# Altium project AD5940PSTAT.PrjPcb
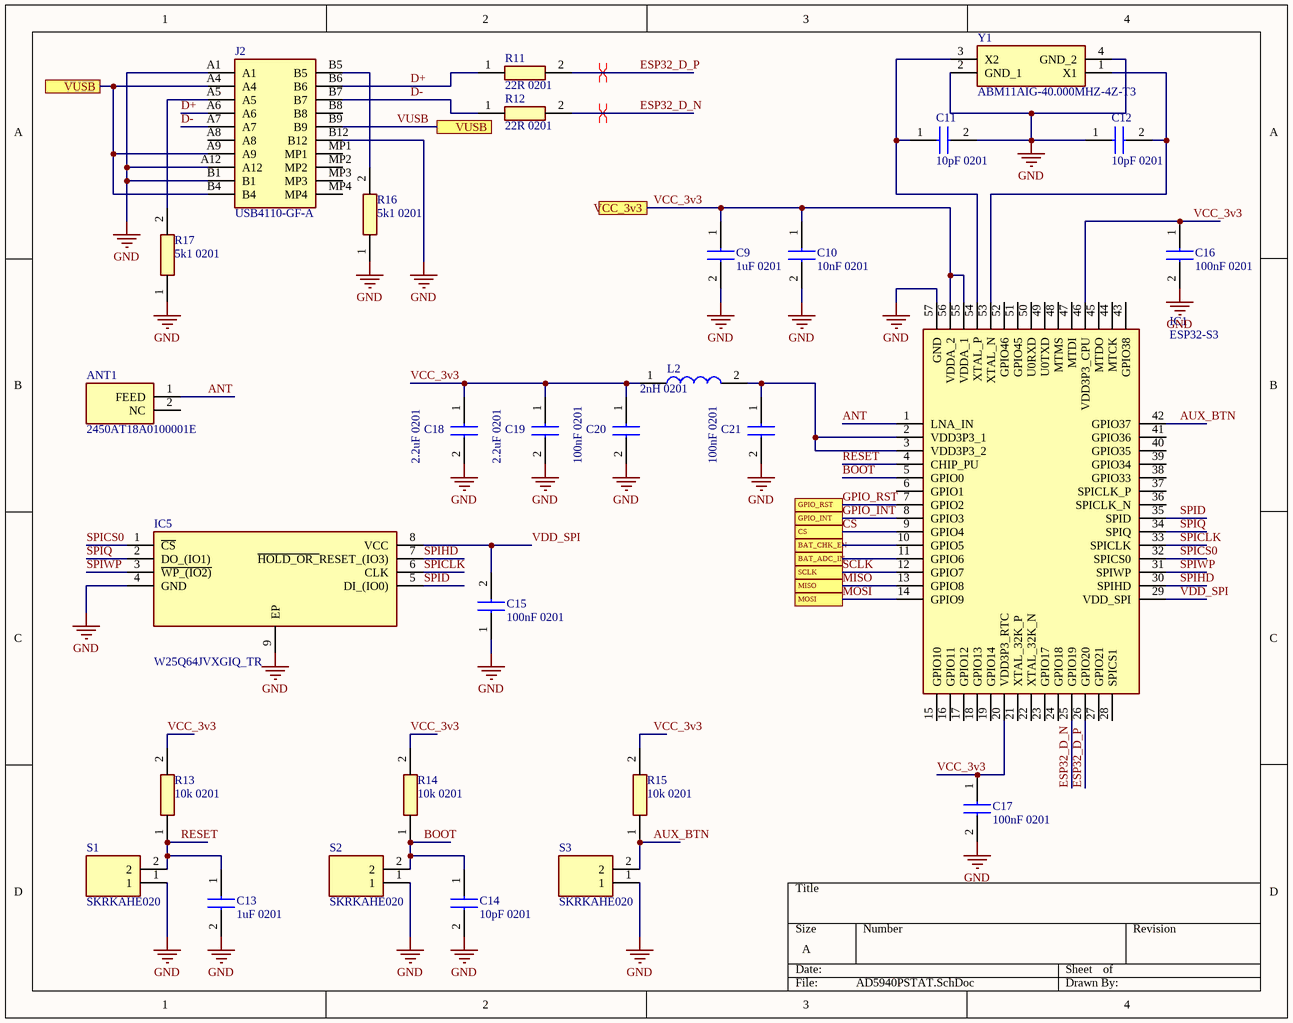
[diagram p0: AD5940PSTAT.SchDoc]
3 sheets, 70 parts. Net scope: flat (ports and power ports of the same name join across sheets).
Board file: AD5940PSTAT.PcbDoc
Sheets:
  AD5940PSTAT.SchDoc
  Battery_MGMT.SchDoc
  AD5940.SchDoc

## Sheet AD5940PSTAT.SchDoc
size A; SheetNumber: 1; SheetTotal: 3

### Parts
ANT1  2450AT18A0100001E  [2450AT18A0100001E]
C9  1uF 0201  [CAPC0603X33N]
C10  10nF 0201  [CAPC0603X33N]
C11  10pF 0201  [CAPC0603X33N]
C12  10pF 0201  [CAPC0603X33N]
C13  1uF 0201  [CAPC0603X33N]
C14  10pF 0201  [CAPC0603X33N]
C15  100nF 0201  [CAPC0603X33N]
C16  100nF 0201  [CAPC0603X33N]
C17  100nF 0201  [CAPC0603X33N]
C18  2.2uF 0201  [CAPC0603X33N]
C19  2.2uF 0201  [CAPC0603X33N]
C20  100nF 0201  [CAPC0603X33N]
C21  100nF 0201  [CAPC0603X33N]
IC1  ESP32-S3  [QFN40P700X700X90-57N-D]
IC5  W25Q64JVXGIQ_TR  [SON80P400X400X50-9N]
J2  USB4110-GF-A  [USB4110GFA]
L2  2nH 0201  [LQP03TG3N1B02D]
R11  22R 0201  [RESC0603X28N]
R12  22R 0201  [RESC0603X28N]
R13  10k 0201  [RESC0603X28N]
R14  10k 0201  [RESC0603X28N]
R15  10k 0201  [RESC0603X28N]
R16  5k1 0201  [RESC0603X28N]
R17  5k1 0201  [RESC0603X28N]
S1  SKRKAHE020  [SKRKAEE020]
S2  SKRKAHE020  [SKRKAEE020]
S3  SKRKAHE020  [SKRKAEE020]
Y1  ABM11AIG-40.000MHZ-4Z-T3  [ABM11AIG16000MHZ81ZT]

### Ports
BAT_ADC_IN (see Battery_MGMT[4B]), BAT_CHK_EN (see Battery_MGMT[3B]), CS (see AD5940[4B]), GPIO_INT (see AD5940[4B]), GPIO_RST (see AD5940[4B]), MISO (see AD5940[4B]), MOSI (see AD5940[4B]), SCLK (see AD5940[4B]), VCC_3v3 (see Battery_MGMT[4C]), VUSB (see AD5940PSTAT[1A], Battery_MGMT[1C]), VUSB (see AD5940PSTAT[2A], Battery_MGMT[1C])

### Nets
GND: C9.2 C10.2 C11.2 C12.1 C13.2 C14.2 C15.1 C16.2 C17.2 C18.2 C19.2 C20.2 C21.2 IC1.57(GND) IC5.4(GND) IC5.9(EP) J2.A1 J2.A12 J2.B1 J2.B12 R16.1 R17.1 S1.1 S2.1 S3.1 Y1.2(GND_1) Y1.4(GND_2)
\: C14.1 IC1.5(GPIO0) R14.1 S2.2  [also labelled BOOT]
ANT: ANT1.1(FEED) IC1.1(LNA_IN)
AUX_BTN: IC1.42(GPIO37) R15.1 S3.2
CS: IC1.9(GPIO4) ; port CS
D+: J2.A6 J2.B6 R11.1
D-: J2.A7 J2.B7 R12.1
ESP32_D_N: IC1.25(GPIO19) R12.2
ESP32_D_P: IC1.26(GPIO20) R11.2
GPIO_INT: IC1.8(GPIO3) ; port GPIO_INT
GPIO_RST: IC1.7(GPIO2) ; port GPIO_RST
MISO: IC1.13(GPIO8) ; port MISO
MOSI: IC1.14(GPIO9) ; port MOSI
RESET: C13.1 IC1.4(CHIP_PU) R13.1 S1.2
SCLK: IC1.12(GPIO7) ; port SCLK
SPICLK: IC1.33(SPICLK) IC5.6(CLK)
SPICS0: IC1.32(SPICS0) IC5.1(~{CS})
SPID: IC1.35(SPID) IC5.5(DI_(IO0))
SPIHD: IC1.30(SPIHD) IC5.7(~{HOLD_OR_}RESET_(IO3))
SPIQ: IC1.34(SPIQ) IC5.2(DO_(IO1))
SPIWP: IC1.31(SPIWP) IC5.3(~{WP_(IO2)})
VCC_3v3: C9.1 C10.1 C16.1 C17.1 C18.1 C19.1 C20.1 IC1.20(VDD3P3_RTC) IC1.46(VDD3P3_CPU) IC1.55(VDDA_1) IC1.56(VDDA_2) L2.1 R13.2 R14.2 R15.2 ; port VCC_3v3
VDD_SPI: C15.2 IC1.29(VDD_SPI) IC5.8(VCC)
VUSB: J2.A4 J2.A9 J2.B4 J2.B9 ; port VUSB
NetC11_1: C11.1 IC1.54(XTAL_P) Y1.3(X2)
NetC12_2: C12.2 IC1.53(XTAL_N) Y1.1(X1)
NetC21_1: C21.1 IC1.2(VDD3P3_1) IC1.3(VDD3P3_2) L2.2
NetIC1_10: IC1.10(GPIO5) ; port BAT_CHK_EN
NetIC1_11: IC1.11(GPIO6) ; port BAT_ADC_IN
NetJ2_A5: J2.A5 R17.2
NetJ2_B5: J2.B5 R16.2

Not connected (* = marked no-connect by the designer): ANT1 2(NC); IC1 6(GPIO1) 15(GPIO10) 16(GPIO11) 17(GPIO12) 18(GPIO13) 19(GPIO14) 21(XTAL_32K_P) 22(XTAL_32K_N) 23(GPIO17) 24(GPIO18) 27(GPIO21) 28(SPICS1) 36(SPICLK_N) 37(SPICLK_P) 38(GPIO33) 39(GPIO34) 40(GPIO35) 41(GPIO36) 43(GPIO38) 44(MTCK) 45(MTDO) 47(MTDI) 48(MTMS) 49(U0TXD) 50(U0RXD) 51(GPIO45) 52(GPIO46); J2 A8 B8 MP1 MP2 MP3 MP4

### Layout directives
differential pair: ESP32_D_N, ESP32_D_P

### Library data of the parts
ANT1 = 2450AT18A0100001E: Antenna; Manufacturer_Name: JOHANSON TECHNOLOGY; Datasheet Link: https://www.johansontechnology.com/datasheets/2450AT18A100/2450AT18A100.pdf; Height: 1.4mm; Manufacturer_Part_Number: 2450AT18A0100001E
C9-C21 = 02013A0R5BAT2A: Capacitor; Manufacturer_Name: Kyocera AVX; Datasheet Link: http://www.mouser.com/catalog/supplier/library/pdf/AVXSurfaceMountCeramic.pdf; Height: 0.33mm; Manufacturer_Part_Number: 02013A0R5BAT2A; Mouser Part Number: 581-02013A0R5BAT2A; Mouser Price/Stock: https://www.mouser.co.uk/ProductDetail/KYOCERA-AVX/02013A0R5BAT2A?qs=Thry1QCnmXDPtFIq9lj3NA%3D%3D
IC1 = ESP32-S3: Integrated Circuit; Manufacturer_Name: Espressif Systems; Datasheet Link: https://nl.mouser.com/datasheet/2/891/Espressif_ESP32_S3_Datasheet-2904763.pdf; Height: 0.9mm; Manufacturer_Part_Number: ESP32-S3; Mouser Part Number: 356-ESP32-S3; Mouser Price/Stock: https://www.mouser.co.uk/ProductDetail/Espressif-Systems/ESP32-S3?qs=Rp5uXu7WBW%2FNWuUy%252BBihNw%3D%3D
IC5 = W25Q64JVXGIQ_TR: Integrated Circuit; Manufacturer_Name: Winbond; Manufacturer_Part_Number: W25Q64JVXGIQ TR; Datasheet Link: https://www.mouser.com/datasheet/2/949/w25q64jv_revj_03272018_plus-1489671.pdf; Height: 0.5mm; Mouser Part Number: 454-W25Q64JVXGIQTR; Mouser Price/Stock: https://www.mouser.co.uk/ProductDetail/Winbond/W25Q64JVXGIQ-TR?qs=qSfuJ%252Bfl%2Fd5kgMLGcal3yA%3D%3D; Arrow Part Number: W25Q64JVXGIQ TR; Arrow Price/Stock: https://www.arrow.com/en/products/w25q64jvxgiqtr/winbond-electronics?utm_currency=USD&region=nac
J2 = USB4110-GF-A: Connector; Manufacturer_Name: GCT (GLOBAL CONNECTOR TECHNOLOGY); Datasheet Link: https://gct.co/files/drawings/usb4110.pdf; Height: 3.26mm; Manufacturer_Part_Number: USB4110-GF-A; Mouser Part Number: 640-USB4110-GF-A; Mouser Price/Stock: https://www.mouser.co.uk/ProductDetail/GCT/USB4110-GF-A?qs=KUoIvG%2F9IlYiZvIXQjyJeA%3D%3D
L2 = LQP03TN2N0C02D: Inductor; Manufacturer_Name: Murata Electronics; Datasheet Link: https://search.murata.co.jp/Ceramy/image/img/P02/JELF243C-0015.pdf; Height: 0.33mm; Manufacturer_Part_Number: LQP03TN2N0C02D; Mouser Part Number: 81-LQP03TN2N0C02D; Mouser Price/Stock: https://www.mouser.co.uk/ProductDetail/Murata-Electronics/LQP03TN2N0C02D?qs=e%252BE4OD6MgMf9XeFWsUHDiQ%3D%3D; Arrow Part Number: LQP03TN2N0C02D; Arrow Price/Stock: https://www.arrow.com/en/products/lqp03tn2n0c02d/murata-manufacturing?region=nac
R11-R17 = CPF0201D422RE1: Resistor; Manufacturer_Name: TE Connectivity; Datasheet Link: http://www.te.com/commerce/DocumentDelivery/DDEController?Action=showdoc&DocId=Data+Sheet%7F1773200-1%7FA%7Fpdf%7FEnglish%7FENG_DS_1773200-1_A.pdf%7F4-2176215-6; Height: 0.28mm; Manufacturer_Part_Number: CPF0201D422RE1
S1-S3 = SKRKAHE020: Switch; Manufacturer_Name: ALPS Electric; Datasheet Link: https://www.alps.com/prod/info/E/HTML/Tact/SurfaceMount/SKRK/SKRKAHE020.html; Height: 2mm; Manufacturer_Part_Number: SKRKAHE020; Mouser Part Number: 688-SKRKAHE010; Mouser Price/Stock: https://www.mouser.co.uk/ProductDetail/Alps-Alpine/SKRKAHE020?qs=chTDxNqvsymUfAVYmcFXaw%3D%3D
Y1 = ABM11AIG-40.000MHZ-4Z-T3: Crystal or Oscillator; Manufacturer_Name: ABRACON; Datasheet Link: https://abracon.com/AIGcrystals/ABM11AIG.pdf; Height: 0.55mm; Manufacturer_Part_Number: ABM11AIG-40.000MHZ-4Z-T3; Mouser Part Number: 815-M11AIG-40-4ZT3; Mouser Price/Stock: https://www.mouser.com/Search/Refine.aspx?Keyword=815-M11AIG-40-4ZT3

## Sheet Battery_MGMT.SchDoc
size A; SheetNumber: 2; SheetTotal: 3
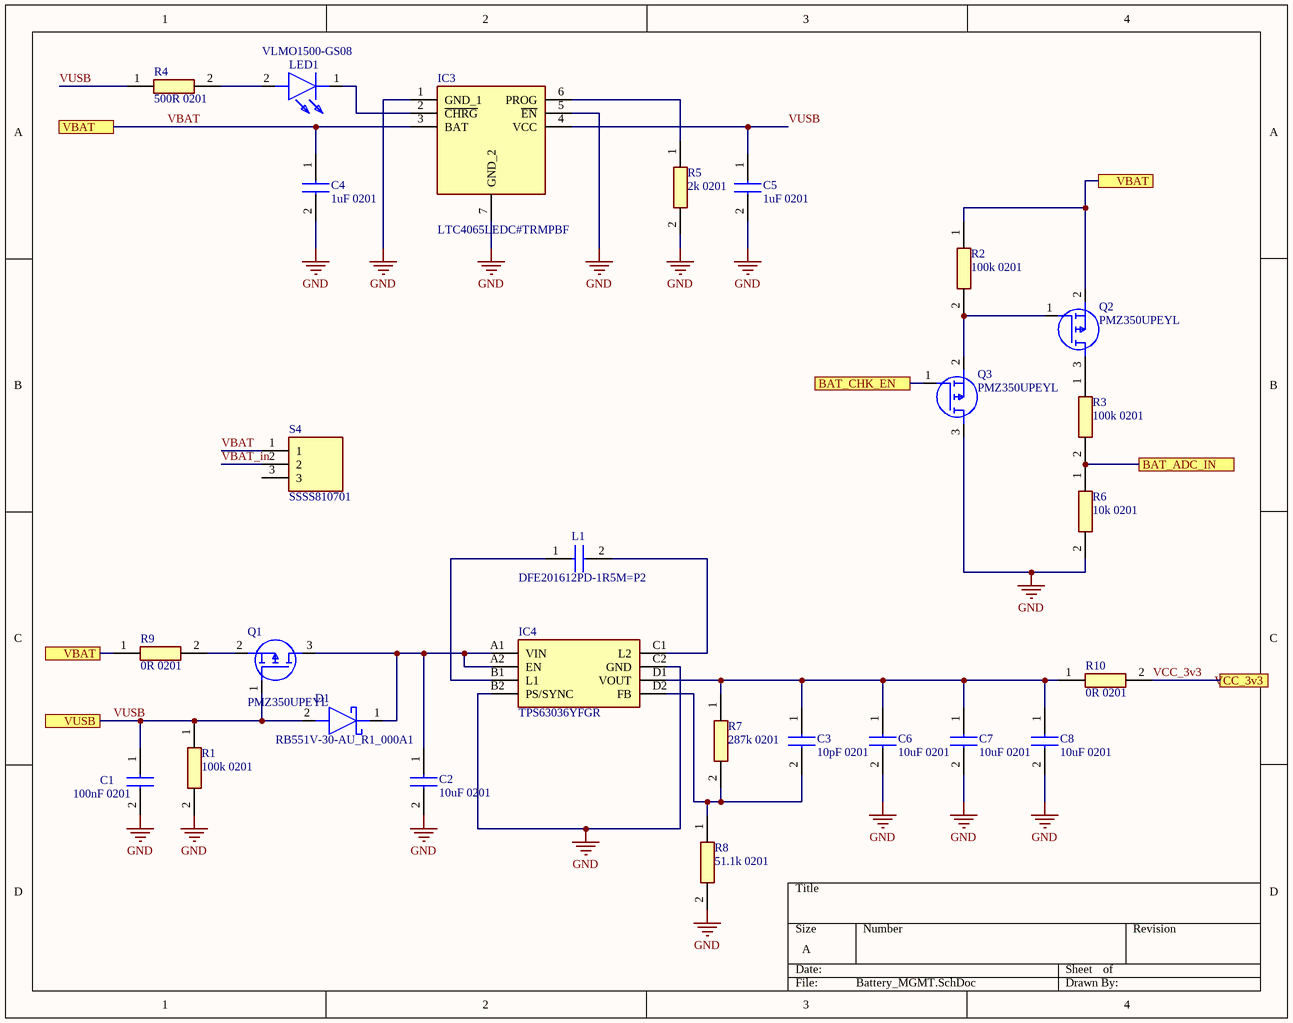
[diagram p1: Battery_MGMT.SchDoc]

### Parts
C1  100nF 0201  [CAPC0603X33N]
C2  10uF 0201  [CAPC0603X33N]
C3  10pF 0201  [CAPC0603X33N]
C4  1uF 0201  [CAPC0603X33N]
C5  1uF 0201  [CAPC0603X33N]
C6  10uF 0201  [CAPC0603X33N]
C7  10uF 0201  [CAPC0603X33N]
C8  10uF 0201  [CAPC0603X33N]
D1  RB551V-30-AU_R1_000A1  [SODFL2512X90N]
IC3  LTC4065LEDC#TRMPBF  [SON50P200X200X80-7N-D]
IC4  TPS63036YFGR  [BGA8C40P2X4_108X181X62]
L1  DFE201612PD-1R5M=P2  [1286ASH1R0MP2]
LED1  VLMO1500-GS08  [VLMO1500GS08]
Q1  PMZ350UPEYL  [PMZ350UPEYL]
Q2  PMZ350UPEYL  [PMZ350UPEYL]
Q3  PMZ350UPEYL  [PMZ350UPEYL]
R1  100k 0201  [RESC0603X28N]
R2  100k 0201  [RESC0603X28N]
R3  100k 0201  [RESC0603X28N]
R4  500R 0201  [RESC0603X28N]
R5  2k 0201  [RESC0603X28N]
R6  10k 0201  [RESC0603X28N]
R7  287k 0201  [RESC0603X28N]
R8  51.1k 0201  [RESC0603X28N]
R9  0R 0201  [RESC0603X28N]
R10  0R 0201  [RESC0603X28N]
S4  SSSS810701  [SSSS810701]

### Ports
BAT_ADC_IN (see AD5940PSTAT[3C]), BAT_CHK_EN (see AD5940PSTAT[3C]), VBAT (see Battery_MGMT[1A], Battery_MGMT[1C]), VBAT (see Battery_MGMT[1A], Battery_MGMT[4A]), VBAT (see Battery_MGMT[1C], Battery_MGMT[4A]), VCC_3v3 (see AD5940[2C], AD5940PSTAT[2A]), VUSB (see AD5940PSTAT[1A], AD5940PSTAT[2A])

### Nets
GND: C1.2 C2.2 C4.2 C5.2 C6.2 C7.2 C8.2 IC3.1(GND_1) IC3.5(~{EN}) IC3.7(GND_2) IC4.B2(PS/SYNC) IC4.C2(GND) Q3.3(D) R1.2 R5.2 R6.2 R8.2
VBAT: C4.1 IC3.3(BAT) Q2.2(S) R2.1 R9.1 S4.1 ; port VBAT
VBAT_in: S4.2
VCC_3v3: R10.2 ; port VCC_3v3
VUSB: C1.1 C5.1 D1.2(A) IC3.4(VCC) Q1.1(G) R1.1 R4.1 ; port VUSB
NetC2_1: C2.1 D1.1(K) IC4.A1(VIN) IC4.A2(EN) Q1.3(D)
NetC3_1: C3.1 C6.1 C7.1 C8.1 IC4.D1(VOUT) R7.1 R10.1
NetC3_2: C3.2 IC4.D2(FB) R7.2 R8.1
NetIC1_10: Q3.1(G) ; port BAT_CHK_EN
NetIC1_11: R3.2 R6.1 ; port BAT_ADC_IN
NetIC3_2: IC3.2(~{CHRG}) LED1.1(K)
NetIC3_6: IC3.6(PROG) R5.1
NetIC4_B1: IC4.B1(L1) L1.1
NetIC4_C1: IC4.C1(L2) L1.2
NetLED1_2: LED1.2(A) R4.2
NetQ1_2: Q1.2(S) R9.2
NetQ2_1: Q2.1(G) Q3.2(S) R2.2
NetQ2_3: Q2.3(D) R3.1

Not connected (* = marked no-connect by the designer): S4 3

### Library data of the parts
C1-C8 = 02013A0R5BAT2A: as C9 on sheet AD5940PSTAT; Datasheet Link: http://www.mouser.com/catalog/supplier/library/pdf/AVXSurfaceMountCeramic.pdf; Height: 0.33mm; Manufacturer_Part_Number: 02013A0R5BAT2A; Mouser Part Number: 581-02013A0R5BAT2A; Mouser Price/Stock: https://www.mouser.co.uk/ProductDetail/KYOCERA-AVX/02013A0R5BAT2A?qs=Thry1QCnmXDPtFIq9lj3NA%3D%3D
D1 = RB551V-30-AU_R1_000A1: Schottky Diode; Manufacturer_Name: PANJIT; Datasheet Link: https://www.panjit.com.tw/upload/datasheet/RB551V-30-AU.pdf; Height: 0.9mm; Manufacturer_Part_Number: RB551V-30-AU_R1_000A1; Mouser Part Number: 241-RB551V30AUR1000A; Mouser Price/Stock: https://www.mouser.co.uk/ProductDetail/Panjit/RB551V-30-AU_R1_000A1?qs=sPbYRqrBIVm52pGNMRAOZw%3D%3D
IC3 = LTC4065LEDC#TRMPBF: Integrated Circuit; Manufacturer_Name: Analog Devices; Datasheet Link: https://www.analog.com/media/en/technical-documentation/data-sheets/LTC4065L-4065LX-4065L-4.1-4065LX-4.1.pdf; Height: 0.8mm; Manufacturer_Part_Number: LTC4065LEDC#TRMPBF; Mouser Part Number: 584-C4065LEDCTRMPBF; Mouser Price/Stock: https://www.mouser.co.uk/ProductDetail/Analog-Devices/LTC4065LEDCTRMPBF?qs=hVkxg5c3xu8%2FWtpri9P%2FRQ%3D%3D; Arrow Part Number: LTC4065LEDC#TRMPBF; Arrow Price/Stock: https://www.arrow.com/en/products/ltc4065ledctrmpbf/analog-devices
IC4 = TPS63036YFGR: Integrated Circuit; Manufacturer_Name: Texas Instruments; Datasheet Link: http://www.ti.com/lit/gpn/tps63036; Height: 0.625mm; Manufacturer_Part_Number: TPS63036YFGR; Mouser Part Number: 595-TPS63036YFGR; Mouser Price/Stock: https://www.mouser.co.uk/ProductDetail/Texas-Instruments/TPS63036YFGR?qs=VMlqFFbv3sRsnODi5hD5bA%3D%3D; Arrow Part Number: TPS63036YFGR; Arrow Price/Stock: https://www.arrow.com/en/products/tps63036yfgr/texas-instruments?region=nac
L1 = DFE201612PD-1R5M=P2: Capacitor; Manufacturer_Name: Murata Electronics; Datasheet Link: https://search.murata.co.jp/Ceramy/image/img/P02/J(E)TE243A-9101.pdf; Height: 1.2mm; Manufacturer_Part_Number: DFE201612PD-1R5M=P2; Mouser Part Number: 81-DFE201612PD1R5P2; Mouser Price/Stock: https://www.mouser.co.uk/ProductDetail/Murata-Electronics/DFE201612PD-1R5M%3dP2?qs=55YtniHzbhABc8Y8Zkr7yw%3D%3D; Arrow Part Number: DFE201612PD-1R5M=P2; Arrow Price/Stock: https://www.arrow.com/en/products/dfe201612pd-1r5mp2/murata-manufacturing
LED1 = VLMO1500-GS08: LED; Manufacturer_Name: Vishay; Datasheet Link: https://www.vishay.com/docs/82554/vlmo1500.pdf; Manufacturer_Part_Number: VLMO1500-GS08; Mouser Part Number: 78-VLMO1500-GS08; Mouser Price/Stock: https://www.mouser.co.uk/ProductDetail/Vishay-Semiconductors/VLMO1500-GS08?qs=2BArZ0I3QlmyRfxEaZ%252BeBw%3D%3D; Arrow Part Number: VLMO1500-GS08; Arrow Price/Stock: https://www.arrow.com/en/products/vlmo1500-gs08/vishay
Q1-Q3 = PMZ350UPEYL: MOSFET (P-Channel); Manufacturer_Name: Nexperia; Datasheet Link: https://assets.nexperia.com/documents/data-sheet/PMZ350UPE.pdf; Height: 0.5mm; Manufacturer_Part_Number: PMZ350UPEYL; Mouser Part Number: 771-PMZ350UPEYL; Mouser Price/Stock: https://www.mouser.co.uk/ProductDetail/Nexperia/PMZ350UPEYL?qs=8qdoF%2F2f1vquuPCxXPSa%252BA%3D%3D; Arrow Part Number: PMZ350UPEYL; Arrow Price/Stock: https://www.arrow.com/en/products/pmz350upeyl/nexperia?utm_currency=USD&region=nac
R1-R10 = CPF0201D422RE1: as R11 on sheet AD5940PSTAT; Datasheet Link: http://www.te.com/commerce/DocumentDelivery/DDEController?Action=showdoc&DocId=Data+Sheet%7F1773200-1%7FA%7Fpdf%7FEnglish%7FENG_DS_1773200-1_A.pdf%7F4-2176215-6; Height: 0.28mm; Manufacturer_Part_Number: CPF0201D422RE1
S4 = SSSS810701: Switch; Manufacturer_Name: ALPS Electric; Datasheet Link: http://www.alps.com/prod/info/E/HTML/Switch/Slide/SSSS8/SSSS810701.html; Manufacturer_Part_Number: SSSS810701; Mouser Part Number: 688-SSSS810701; Mouser Price/Stock: https://www.mouser.co.uk/ProductDetail/Alps-Alpine/SSSS810701?qs=uROlC5LSwk1OL7pdbC2yLg%3D%3D; Arrow Part Number: SSSS810701; Arrow Price/Stock: https://www.arrow.com/en/products/ssss810701/alps-electric

## Sheet AD5940.SchDoc
size A; SheetNumber: 3; SheetTotal: 3
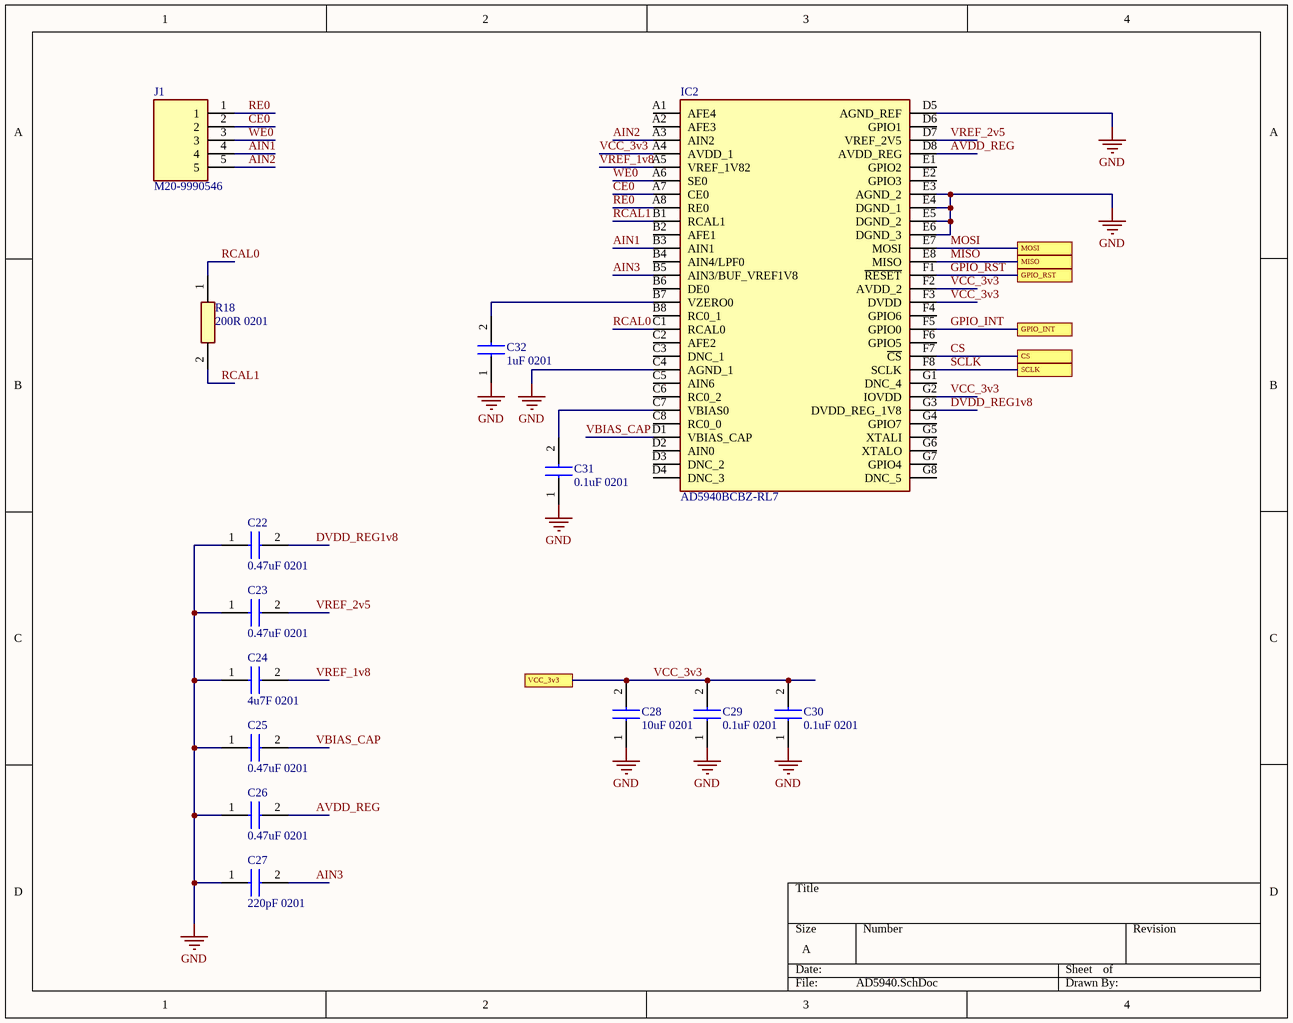
[diagram p2: AD5940.SchDoc]

### Parts
C22  0.47uF 0201  [CAPC0603X33N]
C23  0.47uF 0201  [CAPC0603X33N]
C24  4u7F 0201  [CAPC0603X33N]
C25  0.47uF 0201  [CAPC0603X33N]
C26  0.47uF 0201  [CAPC0603X33N]
C27  220pF 0201  [CAPC0603X33N]
C28  10uF 0201  [CAPC0603X33N]
C29  0.1uF 0201  [CAPC0603X33N]
C30  0.1uF 0201  [CAPC0603X33N]
C31  0.1uF 0201  [CAPC0603X33N]
C32  1uF 0201  [CAPC0603X33N]
IC2  AD5940BCBZ-RL7  [BGA56C40P8X7_416X356X55]
J1  M20-9990546  [HDRV5W64P0X254_1X5_1270X254X610P]
R18  200R 0201  [RESC0603X28N]

### Ports
CS (see AD5940PSTAT[3C]), GPIO_INT (see AD5940PSTAT[3C]), GPIO_RST (see AD5940PSTAT[3B]), MISO (see AD5940PSTAT[3C]), MOSI (see AD5940PSTAT[3C]), SCLK (see AD5940PSTAT[3C]), VCC_3v3 (see AD5940PSTAT[2A], Battery_MGMT[4C])

### Nets
GND: C22.1 C23.1 C24.1 C25.1 C26.1 C27.1 C28.1 C29.1 C30.1 C31.1 C32.1 IC2.C4(AGND_1) IC2.D5(AGND_REF) IC2.E3(AGND_2) IC2.E4(DGND_1) IC2.E5(DGND_2) IC2.E6(DGND_3)
AIN1: IC2.B3(AIN1) J1.4
AIN2: IC2.A3(AIN2) J1.5
AIN3: C27.2 IC2.B5(AIN3/BUF_VREF1V8)
AVDD_REG: C26.2 IC2.D8(AVDD_REG)
CE0: IC2.A7(CE0) J1.2
CS: IC2.F7(~{CS}) ; port CS
DVDD_REG1v8: C22.2 IC2.G3(DVDD_REG_1V8)
GPIO_INT: IC2.F5(GPIO0) ; port GPIO_INT
GPIO_RST: IC2.F1(~{RESET}) ; port GPIO_RST
MISO: IC2.E8(MISO) ; port MISO
MOSI: IC2.E7(MOSI) ; port MOSI
RCAL0: IC2.C1(RCAL0) R18.1
RCAL1: IC2.B1(RCAL1) R18.2
RE0: IC2.A8(RE0) J1.1
SCLK: IC2.F8(SCLK) ; port SCLK
VBIAS_CAP: C25.2 IC2.D1(VBIAS_CAP)
VCC_3v3: C28.2 C29.2 C30.2 IC2.A4(AVDD_1) IC2.F2(AVDD_2) IC2.F3(DVDD) IC2.G2(IOVDD) ; port VCC_3v3
VREF_1v8: C24.2 IC2.A5(VREF_1V82)
VREF_2v5: C23.2 IC2.D7(VREF_2V5)
WE0: IC2.A6(SE0) J1.3
NetC31_2: C31.2 IC2.C7(VBIAS0)
NetC32_2: C32.2 IC2.B7(VZERO0)

Not connected (* = marked no-connect by the designer): IC2 A1(AFE4) A2(AFE3) B2(AFE1) B4(AIN4/LPF0) B6(DE0) B8(RC0_1) C2(AFE2) C3(DNC_1) C5(AIN6) C6(RC0_2) C8(RC0_0) D2(AIN0) D3(DNC_2) D4(DNC_3) D6(GPIO1) E1(GPIO2) E2(GPIO3) F4(GPIO6) F6(GPIO5) G1(DNC_4) G4(GPIO7) G5(XTALI) G6(XTALO) G7(GPIO4) G8(DNC_5)

### Library data of the parts
C22-C32 = 02013A0R5BAT2A: as C9 on sheet AD5940PSTAT; Datasheet Link: http://www.mouser.com/catalog/supplier/library/pdf/AVXSurfaceMountCeramic.pdf; Height: 0.33mm; Manufacturer_Part_Number: 02013A0R5BAT2A; Mouser Part Number: 581-02013A0R5BAT2A; Mouser Price/Stock: https://www.mouser.co.uk/ProductDetail/KYOCERA-AVX/02013A0R5BAT2A?qs=Thry1QCnmXDPtFIq9lj3NA%3D%3D
IC2 = AD5940BCBZ-RL7: Integrated Circuit; Manufacturer_Name: Analog Devices; Datasheet Link: https://www.analog.com/media/en/technical-documentation/data-sheets/AD5940-5941.pdf; Height: 0.55mm; Manufacturer_Part_Number: AD5940BCBZ-RL7; Mouser Part Number: 584-AD5940BCBZ-RL7; Mouser Price/Stock: https://www.mouser.co.uk/ProductDetail/Analog-Devices/AD5940BCBZ-RL7?qs=vLWxofP3U2xw9N0DLKMjhg%3D%3D; Arrow Part Number: AD5940BCBZ-RL7; Arrow Price/Stock: https://www.arrow.com/en/products/ad5940bcbz-rl7/analog-devices?region=nac
J1 = M20-9990546: Connector; Manufacturer_Name: Harwin; Datasheet Link: https://cdn.harwin.com/pdfs/M20-999.pdf; Height: 6.1mm; Manufacturer_Part_Number: M20-9990546; Mouser Part Number: 855-M20-9990546; Mouser Price/Stock: https://www.mouser.co.uk/ProductDetail/Harwin/M20-9990546?qs=ulE8k0yEMYY8EKyDN9ic6A%3D%3D
R18 = CPF0201D422RE1: as R11 on sheet AD5940PSTAT; Datasheet Link: http://www.te.com/commerce/DocumentDelivery/DDEController?Action=showdoc&DocId=Data+Sheet%7F1773200-1%7FA%7Fpdf%7FEnglish%7FENG_DS_1773200-1_A.pdf%7F4-2176215-6; Height: 0.28mm; Manufacturer_Part_Number: CPF0201D422RE1

## Nets that join several sheets
GND: AD5940PSTAT (27 pins), Battery_MGMT (17 pins), AD5940 (17 pins)
CS: AD5940PSTAT (IC1.9), AD5940 (IC2.F7)
GPIO_INT: AD5940PSTAT (IC1.8), AD5940 (IC2.F5)
GPIO_RST: AD5940PSTAT (IC1.7), AD5940 (IC2.F1)
MISO: AD5940PSTAT (IC1.13), AD5940 (IC2.E8)
MOSI: AD5940PSTAT (IC1.14), AD5940 (IC2.E7)
NetIC1_10: AD5940PSTAT (IC1.10), Battery_MGMT (Q3.1)
NetIC1_11: AD5940PSTAT (IC1.11), Battery_MGMT (R3.2 R6.1)
SCLK: AD5940PSTAT (IC1.12), AD5940 (IC2.F8)
VCC_3v3: AD5940PSTAT (15 pins), Battery_MGMT (R10.2), AD5940 (7 pins)
VUSB: AD5940PSTAT (J2.A4 J2.A9 J2.B4 J2.B9), Battery_MGMT (7 pins)